# EAGLE design Shutdown_circuit_logic_TNN_V1.0 (EAGLE 9.6.2)

## Sheet 1 of 2
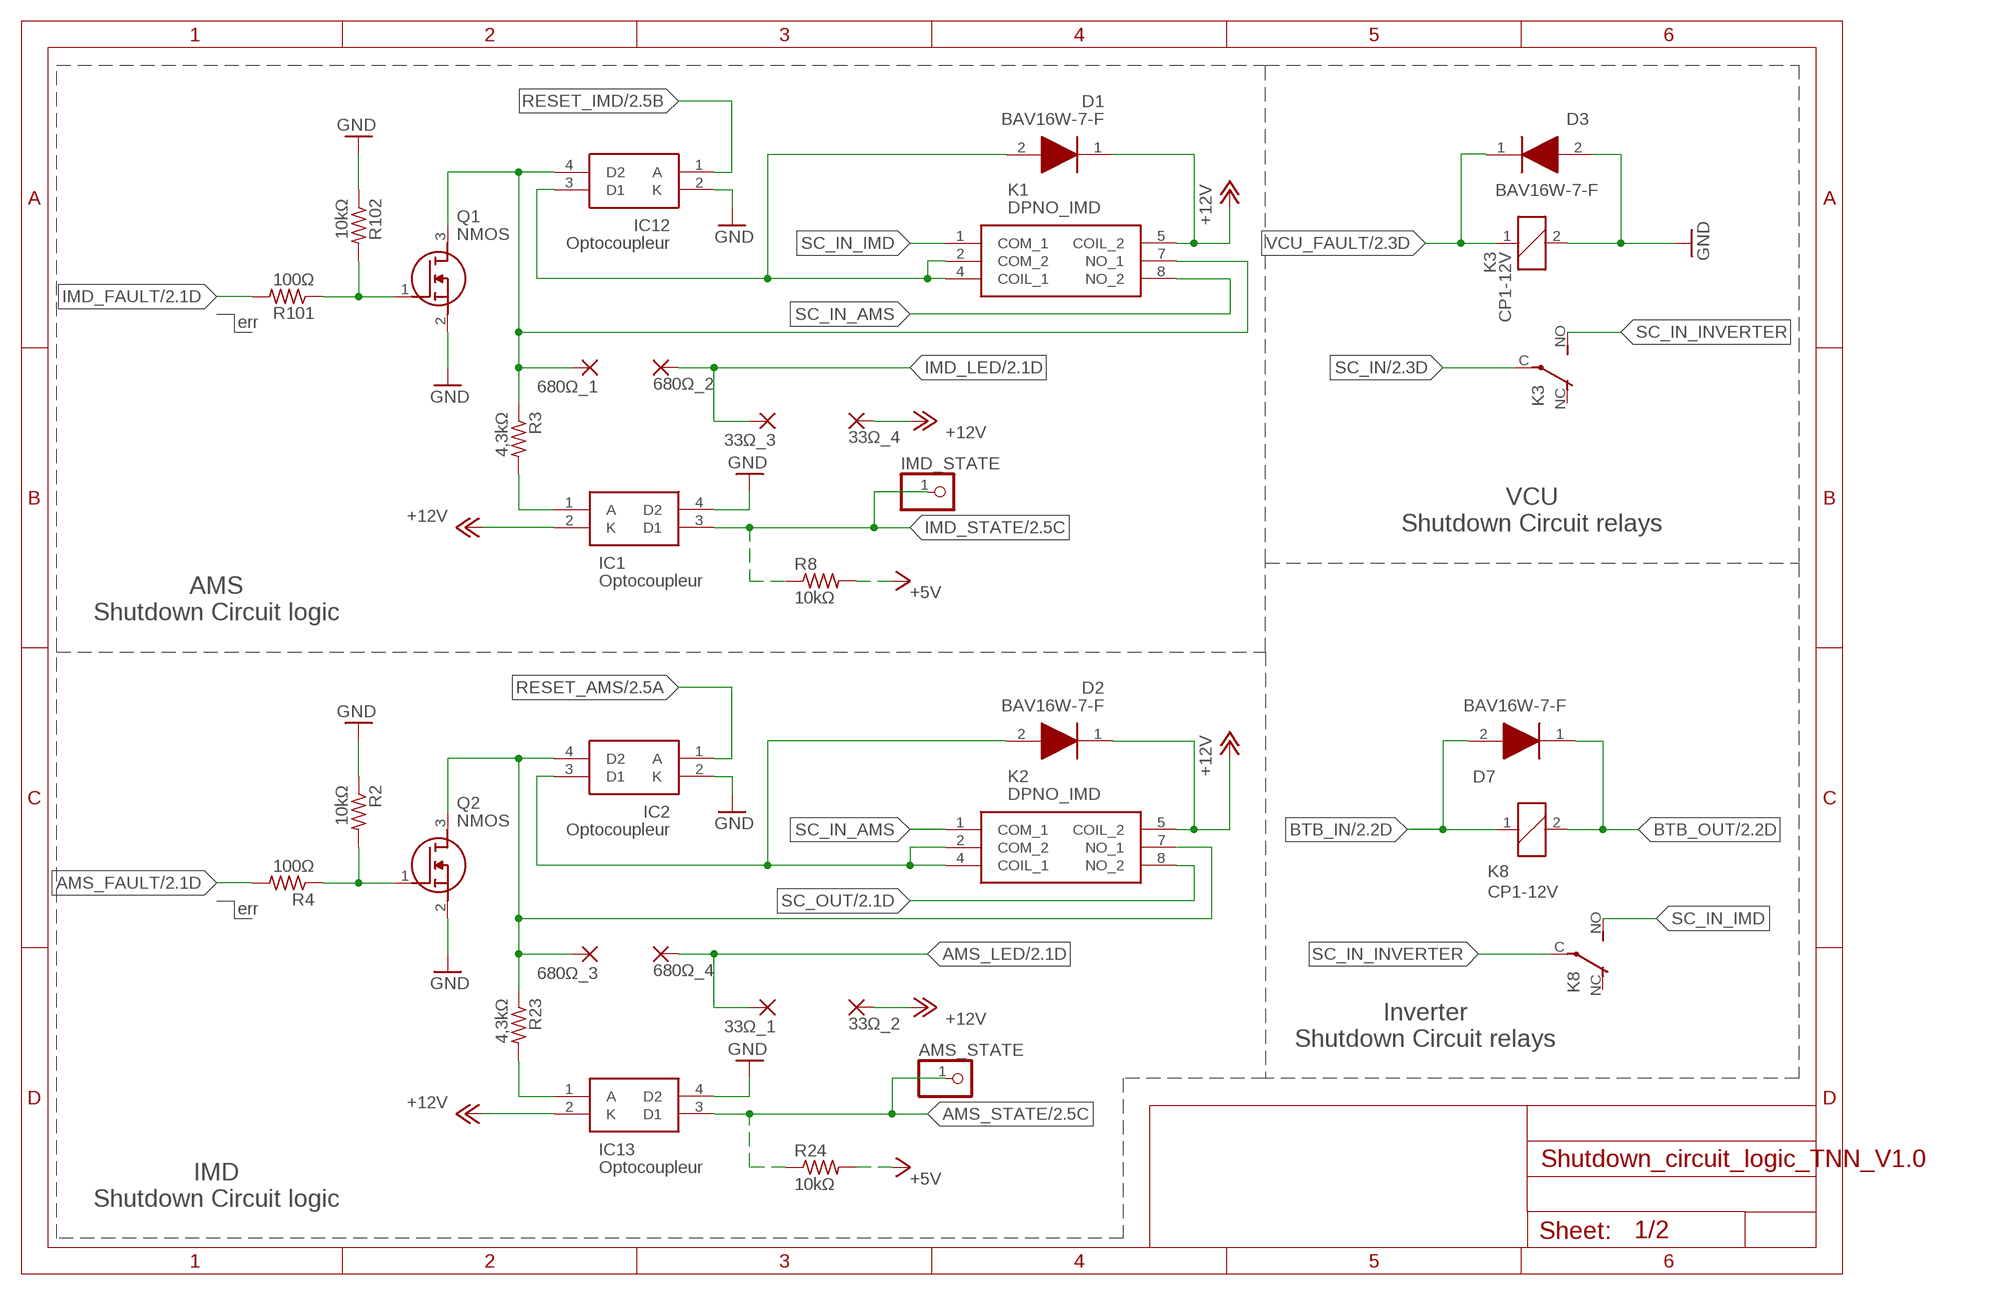
[diagram p0: schematic, sheet 1]

### Parts
33Ω_1  1,6/0,8  [1,6/0,8]
33Ω_2  1,6/0,8  [1,6/0,8]
33Ω_3  1,6/0,8  [1,6/0,8]
33Ω_4  1,6/0,8  [1,6/0,8]
680Ω_1  1,6/0,8  [1,6/0,8]
680Ω_2  1,6/0,8  [1,6/0,8]
680Ω_3  1,6/0,8  [1,6/0,8]
680Ω_4  1,6/0,8  [1,6/0,8]
AMS_STATE  PINHD-1X1  [1X01]
D1  BAV16W-7-F  [SOD3716X145N]
D2  BAV16W-7-F  [SOD3716X145N]
D3  BAV16W-7-F  [SOD3716X145N]
D7  BAV16W-7-F  [SOD3716X145N]
IC1  Optocoupleur  AQY221R2S  [SOP254P680X230-4N]
IC2  Optocoupleur  AQY221R2S  [SOP254P680X230-4N]
IC12  Optocoupleur  AQY221R2S  [SOP254P680X230-4N]
IC13  Optocoupleur  AQY221R2S  [SOP254P680X230-4N]
IMD_STATE  PINHD-1X1  [1X01]
K1  DPNO_IMD  AHES3292  [AHES3292]
K2  DPNO_IMD  AHES3292  [AHES3292]
K3  CP1-12V  [CP1]
K8  CP1-12V  [CP1]
Q1  NMOS  DMN2041L-7  [SOT96P240X110-3N]
Q2  NMOS  DMN2041L-7  [SOT96P240X110-3N]
R2  10kΩ  R-US_R0603  [R0603]
R3  4,3kΩ  R-US_R0603  [R0603]
R4  100Ω  R-US_R0603  [R0603]
R8  10kΩ  R-US_R0603  [R0603]
R23  4,3kΩ  R-US_R0603  [R0603]
R24  10kΩ  R-US_R0603  [R0603]
R101  100Ω  R-US_R0603  [R0603]
R102  10kΩ  R-US_R0603  [R0603]

### Nets
+5V [5V]: R8.2 R24.2 ; also sheet 2
+12V [12V]: 33Ω_2.1(P) 33Ω_4.1(P) D1.1(K) D2.1(K) IC1.2(K) IC13.2(K) K1.5(COIL_2) K2.5(COIL_2) ; also sheet 2
AMS_FAULT: R4.2 ; also sheet 2
AMS_LED: 33Ω_1.1(P) 680Ω_4.1(P) ; also sheet 2
AMS_STATE: AMS_STATE.1 IC13.3(D1) R24.1 ; also sheet 2
BTB_IN: D7.2(A) K8.1 ; also sheet 2
BTB_OUT: D7.1(K) K8.2 ; also sheet 2
GND [Signal]: D3.2(A) IC1.4(D2) IC2.2(K) IC12.2(K) IC13.4(D2) K3.2 Q1.2(S) Q2.2(S) R2.1 R102.1 ; also sheet 2
IMD_FAULT: R101.2 ; also sheet 2
IMD_LED: 33Ω_3.1(P) 680Ω_2.1(P) ; also sheet 2
IMD_STATE: IC1.3(D1) IMD_STATE.1 R8.1 ; also sheet 2
N$5: Q2.1(G) R2.2 R4.1
N$17: Q1.1(G) R101.1 R102.2
N$22: 680Ω_3.1(P) IC2.4(D2) K2.7(NO_1) Q2.3(D) R23.1
N$23: IC1.1(A) R3.2
N$25: 680Ω_1.1(P) IC12.4(D2) K1.7(NO_1) Q1.3(D) R3.1
N$26: D2.2(A) IC2.3(D1) K2.2(COM_2) K2.4(COIL_1)
N$27: IC13.1(A) R23.2
N$29: D1.2(A) IC12.3(D1) K1.2(COM_2) K1.4(COIL_1)
RESET_AMS: IC2.1(A) ; also sheet 2
RESET_IMD: IC12.1(A) ; also sheet 2
SC_IN: K3.C(2:P) ; also sheet 2
SC_IN_AMS: K1.8(NO_2) K2.1(COM_1)
SC_IN_IMD: K1.1(COM_1) K8.NO(2:S)
SC_IN_INVERTER: K3.NO(2:S) K8.C(2:P)
SC_OUT: K2.8(NO_2) ; also sheet 2
VCU_FAULT: D3.1(K) K3.1 ; also sheet 2
Unconnected: K3.NC(2:O) K8.NC(2:O)

### Notes on the sheet
- err
- VCU
  Shutdown Circuit relays
- AMS
  Shutdown Circuit logic
- err
- Inverter
  Shutdown Circuit relays
- IMD
  Shutdown Circuit logic

## Sheet 2 of 2
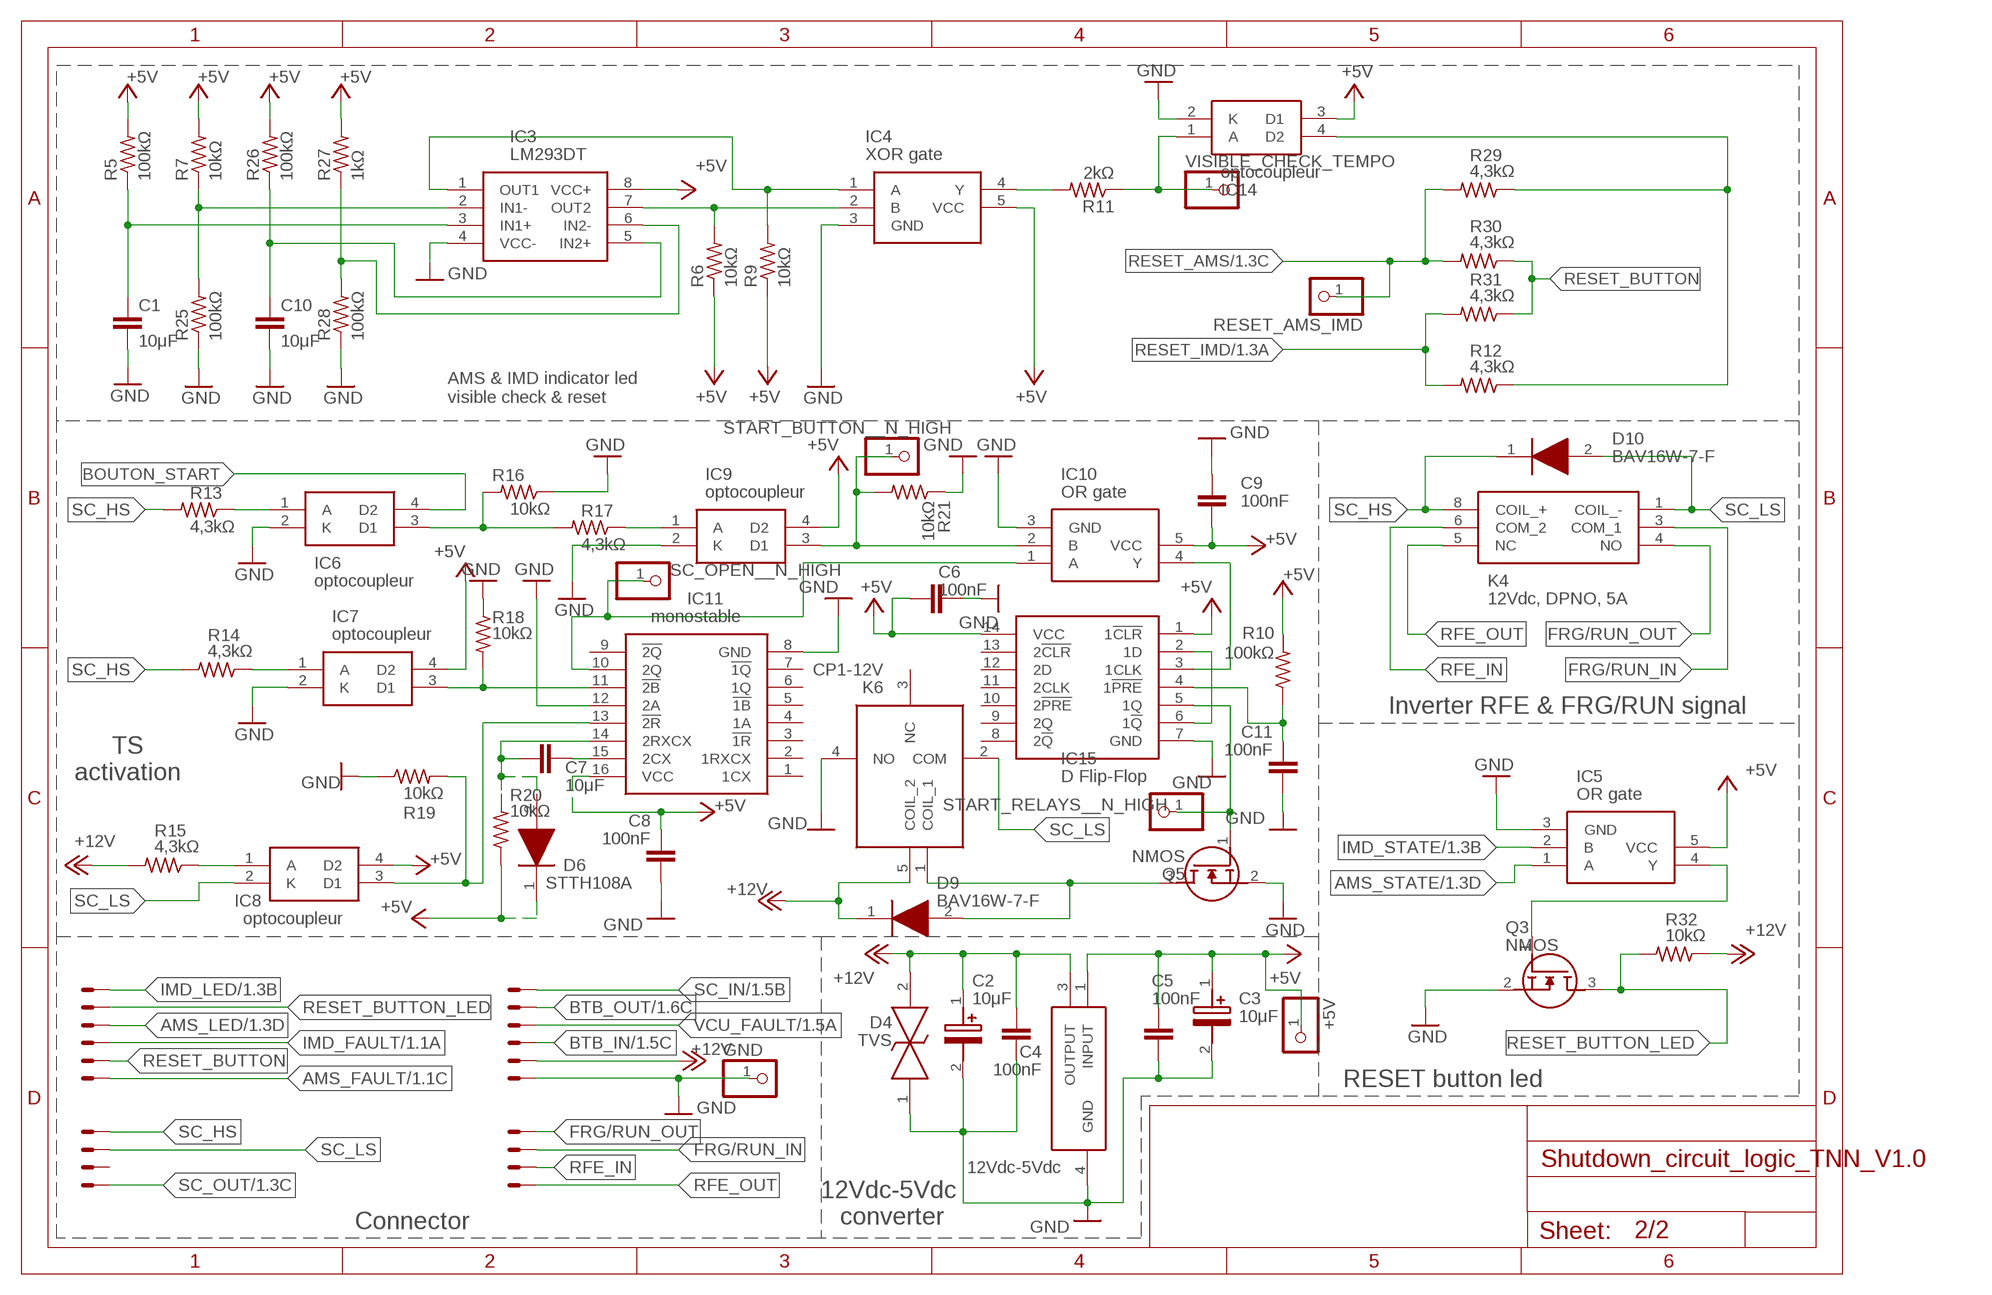
[diagram p1: schematic, sheet 2]

### Parts
+5V  PINHD-1X1  [1X01]
C1  10μF  C-EUC0603  [C0603]
C2  10μF  ECA1VM100  [CAPPRD200W55D525H1200]
C3  10μF  ECA1VM100  [CAPPRD200W55D525H1200]
C4  100nF  C-EUC0603  [C0603]
C5  100nF  C-EUC0603  [C0603]
C6  100nF  C-EUC0603  [C0603]
C7  10μF  C-EUC0603  [C0603]
C8  100nF  C-EUC0603  [C0603]
C9  100nF  C-EUC0603  [C0603]
C10  10μF  C-EUC0603  [C0603]
C11  100nF  C-EUC0603  [C0603]
CONVERTER  12Vdc-5Vdc  L4941BDT-TR  [TO228P972X240-3N]
D4  TVS  CDSOD323-T15SC  [SOD-323]
D6  STTH108A  [DIOM5126X265N]
D9  BAV16W-7-F  [SOD3716X145N]
D10  BAV16W-7-F  [SOD3716X145N]
GND  PINHD-1X1  [1X01]
IC3  LM293DT  [SOIC127P600X175-8N]
IC4  XOR gate  SN74LVC1G86DCKR  [SOT65P210X110-5N]
IC5  OR gate  SN74LVC1G32DBVR  [SOT95P280X145-5N]
IC6  optocoupleur  AQY221R2S  [SOP254P680X230-4N]
IC7  optocoupleur  AQY221R2S  [SOP254P680X230-4N]
IC8  optocoupleur  AQY221R2S  [SOP254P680X230-4N]
IC9  optocoupleur  AQY221R2S  [SOP254P680X230-4N]
IC10  OR gate  SN74LVC1G32DBVR  [SOT95P280X145-5N]
IC11  monostable  CD74HCT4538M96  [SOIC127P600X175-16N]
IC14  optocoupleur  AQY221R2S  [SOP254P680X230-4N]
IC15  D Flip-Flop  SN74AC74DE4  [SOIC127P600X175-14N]
K4  12Vdc, DPNO, 5A  G6B-2214P-US_12DC  [G6B2214PUS12DC]
K6  CP1-12V  [CP1FORMC_1]
Q3  NMOS  DMN2041L-7  [SOT96P240X110-3N]
Q5  NMOS  DMN2041L-7  [SOT96P240X110-3N]
R5  100kΩ  R-US_R0603  [R0603]
R6  10kΩ  R-US_R0603  [R0603]
R7  10kΩ  R-US_R0603  [R0603]
R9  10kΩ  R-US_R0603  [R0603]
R10  100kΩ  R-US_R0603  [R0603]
R11  2kΩ  R-US_R0603  [R0603]
R12  4,3kΩ  R-US_R0603  [R0603]
R13  4,3kΩ  R-US_R0603  [R0603]
R14  4,3kΩ  R-US_R0603  [R0603]
R15  4,3kΩ  R-US_R0603  [R0603]
R16  10kΩ  R-US_R0603  [R0603]
R17  4,3kΩ  R-US_R0603  [R0603]
R18  10kΩ  R-US_R0603  [R0603]
R19  10kΩ  R-US_R0603  [R0603]
R20  10kΩ  R-US_R0603  [R0603]
R21  10kΩ  R-US_R0603  [R0603]
R25  100kΩ  R-US_R0603  [R0603]
R26  100kΩ  R-US_R0603  [R0603]
R27  1kΩ  R-US_R0603  [R0603]
R28  100kΩ  R-US_R0603  [R0603]
R29  4,3kΩ  R-US_R0603  [R0603]
R30  4,3kΩ  R-US_R0603  [R0603]
R31  4,3kΩ  R-US_R0603  [R0603]
R32  10kΩ  R-US_R0603  [R0603]
RESET_AMS_IMD  PINHD-1X1  [1X01]
SC_OPEN__N_HIGH  PINHD-1X1  [1X01]
START_BUTTON__N_HIGH  PINHD-1X1  [1X01]
START_RELAYS__N_HIGH  PINHD-1X1  [1X01]
VISIBLE_CHECK_TEMPO  PINHD-1X1  [1X01]
X1  22-23-2041  [22-23-2041]
X2  22-23-2041  [22-23-2041]
X3  22-23-2061  [22-23-2061]
X4  22-23-2061  [22-23-2061]

### Nets
+5V [5V]: +5V.1 C3.1(+) C5.1 C6.2 C8.2 C9.2 CONVERTER.1(INPUT) D6.1(K) IC3.8(VCC+) IC4.5(VCC) IC5.5(VCC) IC7.4(D2) IC8.4(D2) IC9.4(D2) IC10.5(VCC) IC11.16(VCC) IC14.3(D1) IC15.1(1!CLR) IC15.14(VCC) R5.2 R6.1 R7.2 R9.1 R10.2 R20.1 R26.2 R27.2 ; also sheet 1
+12V [12V]: C2.1(+) C4.1 CONVERTER.3(OUTPUT) D4.2 D9.1(K) K6.5(COIL_2) R15.2 R32.1 X4.2 ; also sheet 1
AMS_FAULT: X3.1 ; also sheet 1
AMS_LED: X3.4 ; also sheet 1
AMS_STATE: IC5.1(A) ; also sheet 1
BOUTON_START: IC6.4(D2)
BTB_IN: X4.3 ; also sheet 1
BTB_OUT: X4.5 ; also sheet 1
FRG/RUN_IN: K4.3(COM_1) X2.3
FRG/RUN_OUT: K4.4(NO) X2.4
GND [Signal]: C1.2 C2.2(-) C3.2(-) C4.2 C5.2 C6.1 C8.1 C9.1 C10.2 C11.1 CONVERTER.4(GND) D4.1 GND.1 IC3.4(VCC-) IC4.3(GND) IC5.3(GND) IC6.2(K) IC7.2(K) IC9.2(K) IC10.3(GND) IC11.8(GND) IC11.12(2A) IC14.2(K) IC15.7(GND) K6.4(NO) Q3.2(S) Q5.2(S) R16.1 R18.1 R19.1 R21.1 R25.1 R28.1 X4.1 ; also sheet 1
IMD_FAULT: X3.3 ; also sheet 1
IMD_LED: X3.6 ; also sheet 1
IMD_STATE: IC5.2(B) ; also sheet 1
N$1: C1.1 IC3.3(IN1+) R5.1
N$2: IC3.2(IN1-) R7.1 R25.2
N$3: IC6.1(A) R13.1
N$4: C10.1 IC3.5(IN2+) R26.1
N$6: IC6.3(D1) R16.2 R17.2
N$7: IC10.1(A) IC11.10(2Q) SC_OPEN__N_HIGH.1
N$8: C7.2 D6.2(A) IC11.14(2RXCX) R20.2
N$9: IC7.1(A) R14.1
N$10: IC7.3(D1) IC11.11(!2B) R18.2
N$11: IC8.1(A) R15.1
N$12: IC8.3(D1) IC11.13(!2R) R19.2
N$13: IC9.1(A) R17.1
N$14: IC9.3(D1) IC10.2(B) R21.2 START_BUTTON__N_HIGH.1
N$15: IC15.5(1Q) Q5.1(G) START_RELAYS__N_HIGH.1
N$16: IC5.4(Y) Q3.1(G)
N$18: IC10.4(Y) IC15.3(1CLK)
N$19: IC3.6(IN2-) R27.1 R28.2
N$20: IC3.1(OUT1) IC4.1(A) R9.2
N$21: IC3.7(OUT2) IC4.2(B) R6.2
N$24: IC14.1(A) R11.1 VISIBLE_CHECK_TEMPO.1
N$37: IC14.4(D2) R12.1 R29.1
N$38: IC4.4(Y) R11.2
N$39: C7.1 IC11.15(2CX)
N$41: IC15.2(1D) IC15.6(1!Q)
N$42: D9.2(A) K6.1(COIL_1) Q5.3(D)
N$43: C11.2 IC15.4(1!PRE) R10.1
RESET_AMS: R29.2 R30.2 RESET_AMS_IMD.1 ; also sheet 1
RESET_BUTTON: R30.1 R31.1 X3.2
RESET_BUTTON_LED: Q3.3(D) R32.2 X3.5
RESET_IMD: R12.2 R31.2 ; also sheet 1
RFE_IN: K4.6(COM_2) X2.2
RFE_OUT: K4.5(NC) X2.1
SC_HS: D10.1(K) K4.8(COIL_+) R13.2 R14.2 X1.4
SC_IN: X4.6 ; also sheet 1
SC_LS: D10.2(A) IC8.2(K) K4.1(COIL_-) K6.2(COM) X1.3
SC_OUT: X1.1 ; also sheet 1
VCU_FAULT: X4.4 ; also sheet 1
Unconnected: IC11.1(1CX) IC11.2(1RXCX) IC11.3(!1R) IC11.4(1A) IC11.5(!1B) IC11.6(1Q) IC11.7(!1Q) IC11.9(!2Q) IC15.8(2!Q) IC15.9(2Q) IC15.10(2!PRE) IC15.11(2CLK) IC15.12(2D) IC15.13(2!CLR) K6.3(NC) X1.2

### Notes on the sheet
- AMS & IMD indicator led
  visible check & reset
- Inverter RFE & FRG/RUN signal
- TS
  activation
- RESET button led
- 12Vdc-5Vdc 
  converter
- Connector

## Library data of the parts
33Ω_1-33Ω_4 680Ω_1-680Ω_4 = wirepad:1,6/0,8: THROUGH-HOLE PAD
+5V AMS_STATE GND IMD_STATE RESET_AMS_IMD SC_OPEN__N_HIGH START_BUTTON__N_HIGH START_RELAYS__N_HIGH VISIBLE_CHECK_TEMPO = pinhead:PINHD-1X1: PIN HEADER
C1 C4-C11 = rcl:C-EU: CAPACITOR, European symbol; SPICEPREFIX: C
C2 C3 = ECA1VM100:ECA1VM100: M radial Al elect cap,10uF 35V 85deg C Panasonic 10uF 35 V dc Aluminium Electrolytic Capacitor, M Series 2000h Source: Datasheet <http://industrial.panasonic.com/cdbs/www-data/pdf/RDF0000/ABA0000C1218.pdf>; DESCRIPTION: M radial Al elect cap,10uF 35V 85deg C Panasonic 10uF 35 V dc Aluminium Electrolytic Capacitor, M Series 2000h; HEIGHT: 12mm; MANUFACTURER_NAME: Panasonic; MANUFACTURER_PART_NUMBER: ECA1VM100
CONVERTER = L4941BDT-TR:L4941BDT-TR: L4941BDT-TR, Low Dropout Voltage Regulator, 1A, 5 V +/-4%, 3-Pin DPAK Source: Datasheet <http://www.st.com/web/en/resource/technical/document/datasheet/CD00000443.pdf>; ARROW_PART_NUMBER: L4941BDT-TR; ARROW_PRICE-STOCK: https://www.arrow.com/en/products/l4941bdt-tr/stmicroelectronics?region=nac; DESCRIPTION: L4941BDT-TR, Low Dropout Voltage Regulator, 1A, 5 V +/-4%, 3-Pin DPAK; HEIGHT: 2.4mm; MANUFACTURER_NAME: STMicroelectronics; MANUFACTURER_PART_NUMBER: L4941BDT-TR; MOUSER_PART_NUMBER: 511-L4941BDT-TR; MOUSER_PRICE-STOCK: https://www.mouser.co.uk/ProductDetail/STMicroelectronics/L4941BDT-TR?qs=tPFdqECvbMIySYN92F2N4Q%3D%3D
D1-D3 D7 = SamacSys_Parts:BAV16W-7-F: Diode Switching 100V 0.15A 2Pin SOD123 Diodes Inc BAV16W-7-F Switching Diode, 300mA 100V, 2-Pin SOD-123 Source: Datasheet; ALLIED_NUMBER: 70437641; DESCRIPTION: Diode Switching 100V 0.15A 2Pin SOD123 Diodes Inc BAV16W-7-F Switching Diode, 300mA 100V, 2-Pin SOD-123; HEIGHT: 1.45mm; MANUFACTURER_NAME: Diodes Inc.; MANUFACTURER_PART_NUMBER: BAV16W-7-F; RS_PART_NUMBER: 7513430P; RS_PRICE-STOCK: http://uk.rs-online.com/web/p/products/7513430P
D4 = CDSOD323-T15SC:CDSOD323-T15SC: TVS Diode ESD 15V BiDirectional SOD323 Bourns CDSOD323-T15SC Bi-Directional TVS Diode, 400W peak, 2-Pin SOD-323 Source: Datasheet <https://datasheet.datasheetarchive.com/originals/distributors/Datasheets-DGA26/1841678.pdf>; ARROW_PART_NUMBER: CDSOD323-T15SC; ARROW_PRICE-STOCK: https://www.arrow.com/en/products/cdsod323-t15sc/bourns?region=nac; DESCRIPTION: TVS Diode ESD 15V BiDirectional SOD323 Bourns CDSOD323-T15SC Bi-Directional TVS Diode, 400W peak, 2-Pin SOD-323; HEIGHT: mm; MANUFACTURER_NAME: Bourns; MANUFACTURER_PART_NUMBER: CDSOD323-T15SC; MOUSER_PART_NUMBER: 652-CDSOD323-T15SC; MOUSER_PRICE-STOCK: https://www.mouser.co.uk/ProductDetail/Bourns/CDSOD323-T15SC?qs=6S5Watp5UnLvz%2FtnS7XuhA%3D%3D
D6 = STTH108A:STTH108A: STTH108A, Fast Rectifier Diode, Switching 1A max, 800V 75ns, 2-Pin, SMA Source: Datasheet <http://www.st.com/web/en/resource/technical/document/datasheet/CD00003259.pdf>; ARROW_PART_NUMBER: STTH108A; ARROW_PRICE-STOCK: https://www.arrow.com/en/products/stth108a/stmicroelectronics; DESCRIPTION: STTH108A, Fast Rectifier Diode, Switching 1A max, 800V 75ns, 2-Pin, SMA; HEIGHT: 2.65mm; MANUFACTURER_NAME: STMicroelectronics; MANUFACTURER_PART_NUMBER: STTH108A; MOUSER_PART_NUMBER: 511-STTH108A; MOUSER_PRICE-STOCK: https://www.mouser.co.uk/ProductDetail/STMicroelectronics/STTH108A?qs=JquAdH79uraWtge35p8qAg%3D%3D
D9 D10 = BAV16W-7-F:BAV16W-7-F: Diode Switching 100V 0.15A 2Pin SOD123 Diodes Inc BAV16W-7-F Switching Diode, 300mA 100V, 2-Pin SOD-123 Source: Datasheet; ARROW_PART_NUMBER: BAV16W-7-F; ARROW_PRICE-STOCK: https://www.arrow.com/en/products/bav16w-7-f/diodes-incorporated; DESCRIPTION: Diode Switching 100V 0.15A 2Pin SOD123 Diodes Inc BAV16W-7-F Switching Diode, 300mA 100V, 2-Pin SOD-123; HEIGHT: 1.45mm; MANUFACTURER_NAME: Diodes Inc.; MANUFACTURER_PART_NUMBER: BAV16W-7-F; MOUSER_PART_NUMBER: 621-BAV16W-F; MOUSER_PRICE-STOCK: https://www.mouser.co.uk/ProductDetail/Diodes-Incorporated/BAV16W-7-F?qs=Ge55vsXlF7cElS2bbKfO8A%3D%3D
IC1 IC2 IC6-IC9 IC12-IC14 = AQY221R2S:AQY221R2S: SPST-NO Solid State Relay 250 mA PCB Mount PhotoMOS, 1.5 V Source: Datasheet <https://datasheet.datasheetarchive.com/originals/distributors/SFDatasheet-4/sf-00084072.pdf>; ARROW_PART_NUMBER: AQY221R2S; ARROW_PRICE-STOCK: https://www.arrow.com/en/products/aqy221r2s/panasonic; DESCRIPTION: SPST-NO Solid State Relay 250 mA PCB Mount PhotoMOS, 1.5 V; HEIGHT: 2.3mm; MANUFACTURER_NAME: Panasonic; MANUFACTURER_PART_NUMBER: AQY221R2S; MOUSER_PART_NUMBER: 769-AQY221R2S; MOUSER_PRICE-STOCK: https://www.mouser.co.uk/ProductDetail/Panasonic-Industrial-Devices/AQY221R2S?qs=mTeSeKeuVA570TSPtWARNQ%3D%3D
IC3 = LM293DT:LM293DT: Low power dual voltage comparators Source: Datasheet <http://www.st.com/web/en/resource/technical/document/datasheet/CD00000465.pdf>; ARROW_PART_NUMBER: LM293DT; ARROW_PRICE-STOCK: https://www.arrow.com/en/products/lm293dt/stmicroelectronics?region=europe; DESCRIPTION: Low power dual voltage comparators; HEIGHT: 1.75mm; MANUFACTURER_NAME: STMicroelectronics; MANUFACTURER_PART_NUMBER: LM293DT; MOUSER_PART_NUMBER: 511-LM293DT; MOUSER_PRICE-STOCK: https://www.mouser.co.uk/ProductDetail/STMicroelectronics/LM293DT?qs=8Bu%252BF5HPnlzADNRUf2Meow%3D%3D
IC4 = SN74LVC1G86DCKR:SN74LVC1G86DCKR: Texas Instruments SN74LVC1G86DCKR, XOR 2 Input XOR, 1.65 5.5 V, 5-Pin SC-70 Source: Datasheet <http://www.ti.com/lit/gpn/sn74lvc1g86>; ARROW_PART_NUMBER: SN74LVC1G86DCKR; ARROW_PRICE-STOCK: https://www.arrow.com/en/products/sn74lvc1g86dckr/texas-instruments?region=nac; DESCRIPTION: Texas Instruments SN74LVC1G86DCKR, XOR 2 Input XOR, 1.65 5.5 V, 5-Pin SC-70; HEIGHT: 1.1mm; MANUFACTURER_NAME: Texas Instruments; MANUFACTURER_PART_NUMBER: SN74LVC1G86DCKR; MOUSER_PART_NUMBER: 595-SN74LVC1G86DCKR; MOUSER_PRICE-STOCK: https://www.mouser.co.uk/ProductDetail/Texas-Instruments/SN74LVC1G86DCKR?qs=d9gICRQKuCdmtPquTT%2F3UA%3D%3D
IC5 IC10 = SN74LVC1G32DBVR:SN74LVC1G32DBVR: Texas Instruments SN74LVC1G32DBVR, 2-Input OR Logic Gate, 1.65 5.5 V, 5-Pin SOT-23 Source: Datasheet <http://www.ti.com/lit/gpn/sn74lvc1g32>; ARROW_PART_NUMBER: SN74LVC1G32DBVR; ARROW_PRICE-STOCK: https://www.arrow.com/en/products/sn74lvc1g32dbvr/texas-instruments?region=nac; DESCRIPTION: Texas Instruments SN74LVC1G32DBVR, 2-Input OR Logic Gate, 1.65 5.5 V, 5-Pin SOT-23; HEIGHT: 1.45mm; MANUFACTURER_NAME: Texas Instruments; MANUFACTURER_PART_NUMBER: SN74LVC1G32DBVR; MOUSER_PART_NUMBER: 595-SN74LVC1G32DBVR; MOUSER_PRICE-STOCK: https://www.mouser.co.uk/ProductDetail/Texas-Instruments/SN74LVC1G32DBVR?qs=3pnr37ZAbK%2F6ArGi%2FPb2Ng%3D%3D
IC11 = CD74HCT4538M96:CD74HCT4538M96: Texas Instruments CD74HCT4538M96 Dual Monostable Multivibrator 4mA, 4.5 5.5 V, 16-Pin SOIC Source: Datasheet <https://www.ti.com/lit/ds/symlink/cd74hct4538.pdf?ts=1617776233717&ref_url=https%3A%2F%2Fwww.ti.com%2Fstore%2Fti%2Fen%2Fp%2Fproduct%2F%3Fp%3DCD74HCT4538M96%26keyMatch%3DCD74HCT4538M96%26tisearch%3Dsearch-everything%26usecas>; ARROW_PART_NUMBER: CD74HCT4538M96; ARROW_PRICE-STOCK: https://www.arrow.com/en/products/cd74hct4538m96/texas-instruments; DESCRIPTION: Texas Instruments CD74HCT4538M96 Dual Monostable Multivibrator 4mA, 4.5 5.5 V, 16-Pin SOIC; HEIGHT: 1.75mm; MANUFACTURER_NAME: Texas Instruments; MANUFACTURER_PART_NUMBER: CD74HCT4538M96; MOUSER_PART_NUMBER: 595-CD74HCT4538M96; MOUSER_PRICE-STOCK: https://www.mouser.com/Search/Refine.aspx?Keyword=595-CD74HCT4538M96
IC15 = SN74AC74DE4:SN74AC74DE4: Flip-Flops Dual Pos-Edge-Trig D-Type Flip-Flop Source: Datasheet <http://www.ti.com/general/docs/suppproductinfo.tsp?distId=26&gotoUrl=http://www.ti.com/lit/gpn/sn74ac74>; DESCRIPTION: Flip-Flops Dual Pos-Edge-Trig D-Type Flip-Flop; HEIGHT: 1.75mm; MANUFACTURER_NAME: Texas Instruments; MANUFACTURER_PART_NUMBER: SN74AC74DE4; MOUSER_PART_NUMBER: 595-SN74AC74DE4; MOUSER_PRICE-STOCK: https://www.mouser.co.uk/ProductDetail/Texas-Instruments/SN74AC74DE4?qs=pdM4geFiyZSonhSZLAytyw%3D%3D
K1 K2 = AHES3292:AHES3292: General Purpose Relays ThruHole,24VDC Coil 30x36x40, 35A Source: Datasheet <https://www.mouser.com/datasheet/2/315/mech_eng_hes-1299274.pdf>; ARROW_PART_NUMBER: AHES3292; ARROW_PRICE-STOCK: https://www.arrow.com/en/products/ahes3292/panasonic; DESCRIPTION: General Purpose Relays ThruHole,24VDC Coil 30x36x40, 35A; HEIGHT: 40mm; MANUFACTURER_NAME: Panasonic; MANUFACTURER_PART_NUMBER: AHES3292; MOUSER_PART_NUMBER: 769-AHES3292; MOUSER_PRICE-STOCK: https://www.mouser.co.uk/ProductDetail/Panasonic-Industrial-Devices/AHES3292/?qs=uLrlhPoGzACCyWNQTcfPfA%3D%3D
K3 K8 = relay:CP1?-*: ULTRA-MINIATURE LOW PROFILE AUTOMOTIVE RELAY NAiS Source: http://www.mew-europe.com/.. en_ds_61207_0000.pdf; MF: AROMAT/ MATSUSHITA; MPN: CP1-12V; OC_FARNELL: unknown; OC_NEWARK: 10C5508
K4 = G6B-2214P-US_12DC:G6B-2214P-US_12DC: RELAY, DPST-NO, 250VAC, 30VDC, 5A Source: Datasheet <https://www.omron.com/ecb/products/pdf/en-g6b.pdf>; DESCRIPTION: RELAY, DPST-NO, 250VAC, 30VDC, 5A; HEIGHT: 11mm; MANUFACTURER_NAME: Omron Electronics; MANUFACTURER_PART_NUMBER: G6B-2214P-US 12DC
K6 = CP1-12V:CP1-12V: PANASONIC ELECTRIC WORKS - CP1-12V - RELAY, AUTOMOTIVE, SPDT, 14VDC, 20A Source: Datasheet <http://www.farnell.com/datasheets/1809465.pdf>; ARROW_PART_NUMBER: CP1-12V; ARROW_PRICE-STOCK: https://www.arrow.com/en/products/cp1-12v/panasonic?region=nac; DESCRIPTION: PANASONIC ELECTRIC WORKS - CP1-12V - RELAY, AUTOMOTIVE, SPDT, 14VDC, 20A; HEIGHT: mm; MANUFACTURER_NAME: Panasonic; MANUFACTURER_PART_NUMBER: CP1-12V; MOUSER_PART_NUMBER: 769-CP1-12V; MOUSER_PRICE-STOCK: https://www.mouser.co.uk/ProductDetail/Panasonic-Industrial-Devices/CP1-12V?qs=mTeSeKeuVA7dPPafy7M16g%3D%3D
Q1 Q2 = SamacSys_Parts:DMN2041L-7: Diodes Inc DMN2041L-7 N-channel MOSFET Transistor, 6.4 A, 20 V, 3-Pin SOT-23 Source: Datasheet <https://datasheet.datasheetarchive.com/originals/distributors/Datasheets-DGA23/1582050.pdf>; ARROW_PART_NUMBER: DMN2041L-7; ARROW_PRICE-STOCK: https://www.arrow.com/en/products/dmn2041l-7/diodes-incorporated?region=nac; DESCRIPTION: Diodes Inc DMN2041L-7 N-channel MOSFET Transistor, 6.4 A, 20 V, 3-Pin SOT-23; HEIGHT: 1.1mm; MANUFACTURER_NAME: Diodes Inc.; MANUFACTURER_PART_NUMBER: DMN2041L-7; MOUSER_PART_NUMBER: 621-DMN2041L-7; MOUSER_PRICE-STOCK: https://www.mouser.co.uk/ProductDetail/Diodes-Incorporated/DMN2041L-7?qs=tiksPeNXt0LSbn3jTreVOg%3D%3D
Q3 Q5 = DMN2041L-7:DMN2041L-7: Diodes Inc DMN2041L-7 N-channel MOSFET Transistor, 6.4 A, 20 V, 3-Pin SOT-23 Source: Datasheet <https://datasheet.datasheetarchive.com/originals/distributors/Datasheets-DGA23/1582050.pdf>; ARROW_PART_NUMBER: DMN2041L-7; ARROW_PRICE-STOCK: https://www.arrow.com/en/products/dmn2041l-7/diodes-incorporated?region=nac; DESCRIPTION: Diodes Inc DMN2041L-7 N-channel MOSFET Transistor, 6.4 A, 20 V, 3-Pin SOT-23; HEIGHT: 1.1mm; MANUFACTURER_NAME: Diodes Inc.; MANUFACTURER_PART_NUMBER: DMN2041L-7; MOUSER_PART_NUMBER: 621-DMN2041L-7; MOUSER_PRICE-STOCK: https://www.mouser.co.uk/ProductDetail/Diodes-Incorporated/DMN2041L-7?qs=tiksPeNXt0LSbn3jTreVOg%3D%3D
R2-R21 R23-R32 R101 R102 = rcl:R-US_: RESISTOR, American symbol; SPICEPREFIX: R
X1 X2 = con-molex:22-23-2041: .100" (2.54mm) Center Header - 4 Pin; MF: MOLEX; MPN: 22-23-2041; OC_FARNELL: 1462920; OC_NEWARK: 38C0355
X3 X4 = con-molex:22-23-2061: .100" (2.54mm) Center Header - 6 Pin; MF: MOLEX; MPN: 22-23-2061; OC_FARNELL: 1462922; OC_NEWARK: 27C1933

## Net classes
0 default: clearance 0.2 mm
1 5V: width 0.2 mm, drill 0.4 mm, clearance 0.2 mm
2 12V: width 0.2 mm, drill 0.6 mm, clearance 0.2 mm
3 Signal: width 0.2 mm, drill 0.3 mm, clearance 0.2 mm

## Board
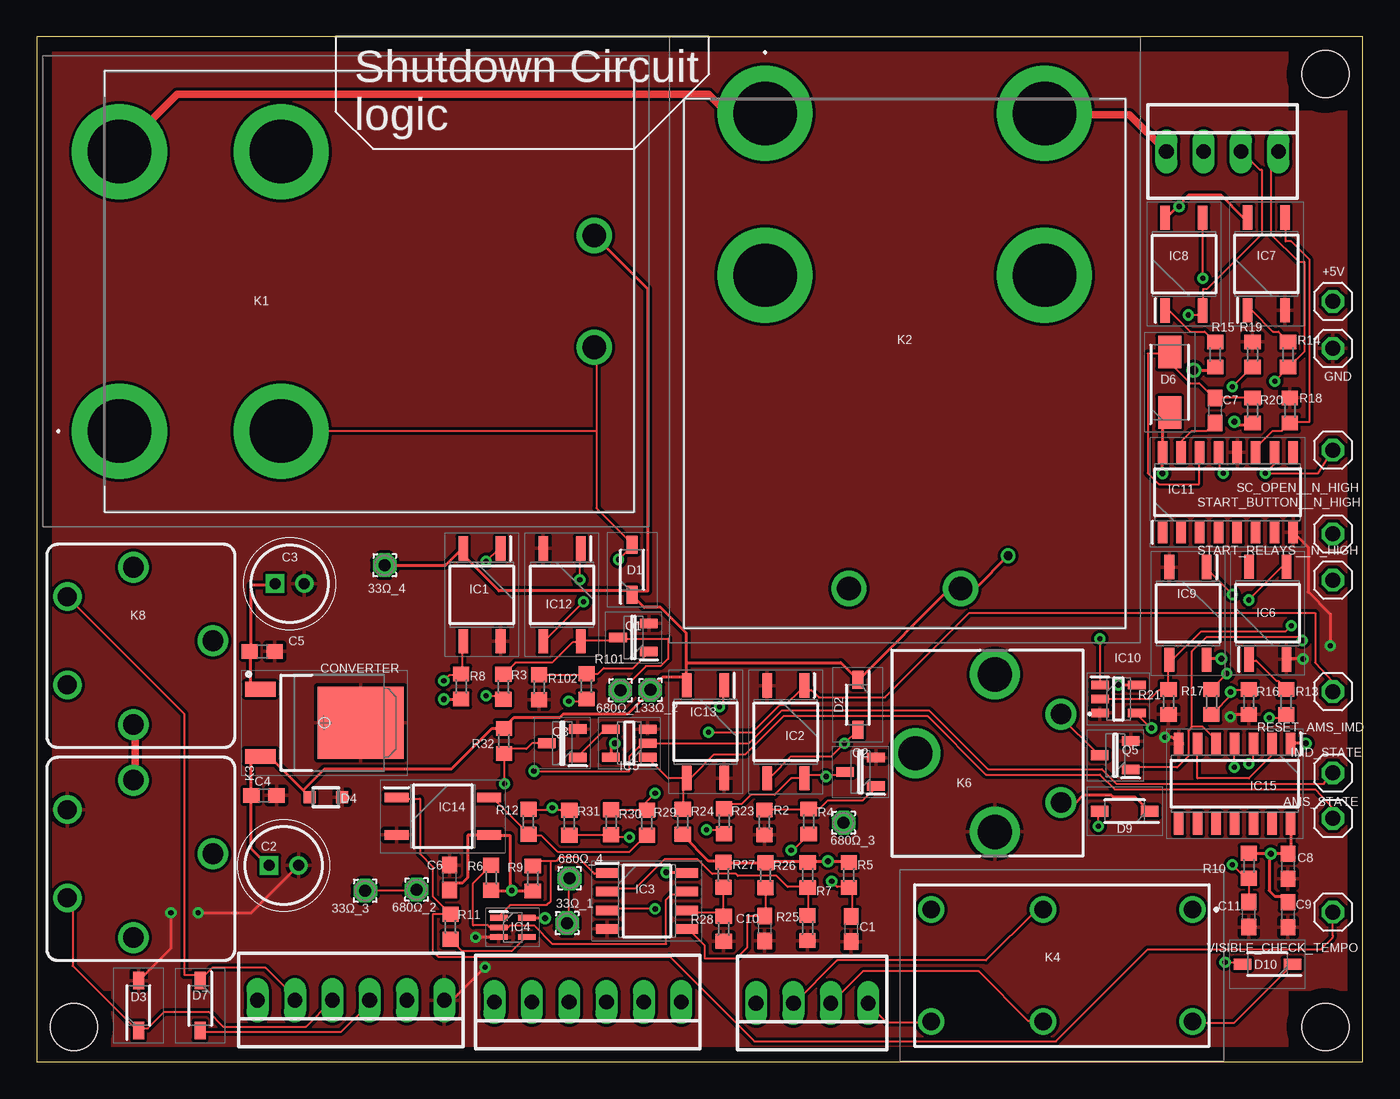
[diagram p2: board, top side]
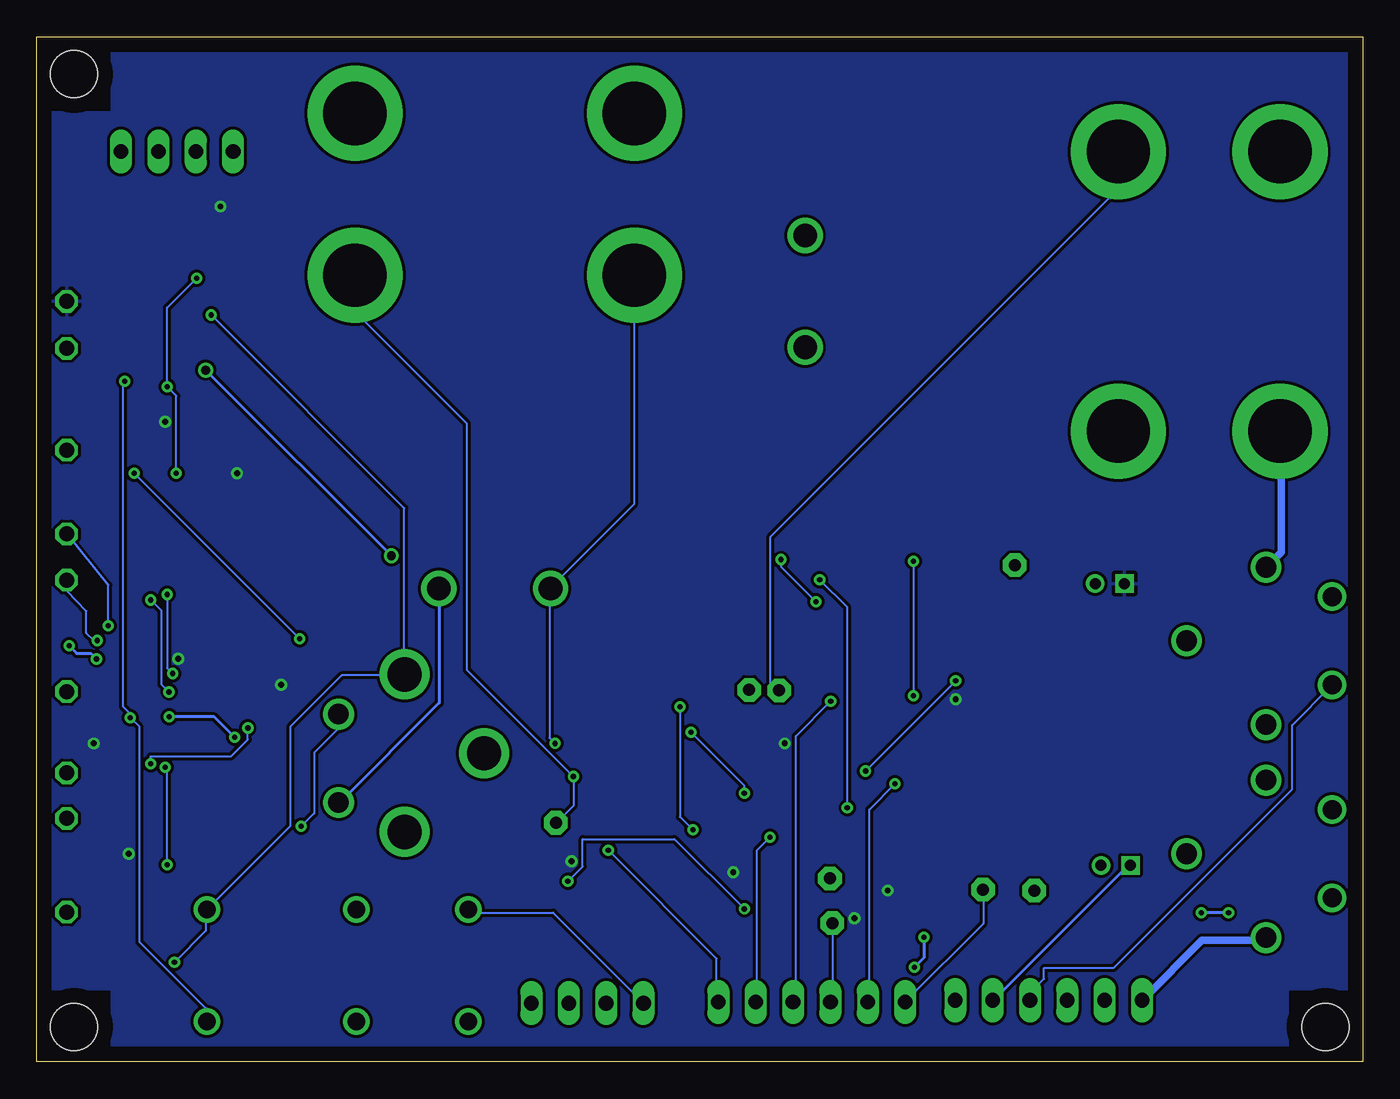
[diagram p3: board, bottom side, seen from below]

Size 90.17 x 69.69 mm. Coordinates in mm from the lower left corner, seen from the top.
Outline: 0,0 90.17,0.01 90.17,69.69 0,69.68 0,0
Copper layers (1*16): Top 0.035mm / dielectric 1.5mm / Bottom 0.035mm
Design rules "default": minimum track width 6mil, minimum drill 0.35mm, track to track 6mil, track to pad 6mil, pad to pad 6mil, via to via 6mil, smd to smd 6mil, copper to edge 40mil, drill to drill 6mil, minimum pad ring 10mil, minimum via ring 8mil, stop-mask expansion 4mil, vias tented up to drill 0mil, thermal gap 10mil
Holes 3.2 mm at 2.54,2.38 87.63,2.38 87.63,67.15

### Footprints (pad centres in the part's own frame; a part is rotated, then mirrored left to right if it is on the bottom)
1,6/0,8 = drill 0.813 pad 1.6 octagon: 1 0,0
1X01 = drill 1.016 octagon: 1 0,0
C0603 = smd 1.1 x 1: 1 -0.85,0; 2 0.85,0
CAPPRD200W55D525H1200 = drill 0.75 pad 1.15 square: 1 0,0 | drill 0.75 pad 1.15: 2 2,0
TO228P972X240-3N = smd 2.1 x 1: 1 -4.35,2.28; 3 -4.35,-2.28 | smd 5.85 x 4.9: 4 2.45,0
SOD3716X145N = smd 1.2 x 0.75: 1 -1.7,0; 2 1.7,0
SOD-323 = smd 0.8 x 0.8: 1 -1.1,0; 2 1.1,0
DIOM5126X265N = smd 2.2 x 1.55: 1 -2.05,0; 2 2.05,0
SOP254P680X230-4N = smd 1.65 x 0.65: 1 -3.15,1.27; 2 -3.15,-1.27; 3 3.15,-1.27; 4 3.15,1.27
SOIC127P600X175-8N = smd 1.525 x 0.65: 1 -2.712,1.905; 2 -2.712,0.635; 3 -2.712,-0.635; 4 -2.712,-1.905; 5 2.712,-1.905; 6 2.712,-0.635; 7 2.712,0.635; 8 2.712,1.905
SOT65P210X110-5N = smd 1.2 x 0.4: 1 -0.95,0.65; 2 -0.95,0; 3 -0.95,-0.65; 4 0.95,-0.65; 5 0.95,0.65
SOT95P280X145-5N = smd 1.2 x 0.6: 1 -1.25,0.95; 2 -1.25,0; 3 -1.25,-0.95; 4 1.25,-0.95; 5 1.25,0.95
SOIC127P600X175-16N = smd 1.525 x 0.65: 1 -2.712,4.445; 2 -2.712,3.175; 3 -2.712,1.905; 4 -2.712,0.635; 5 -2.712,-0.635; 6 -2.712,-1.905; 7 -2.712,-3.175; 8 -2.712,-4.445; 9 2.712,-4.445; 10 2.712,-3.175; 11 2.712,-1.905; 12 2.712,-0.635; 13 2.712,0.635; 14 2.712,1.905; 15 2.712,3.175; 16 2.712,4.445
SOIC127P600X175-14N = smd 1.525 x 0.65: 1 -2.712,3.81; 2 -2.712,2.54; 3 -2.712,1.27; 4 -2.712,0; 5 -2.712,-1.27; 6 -2.712,-2.54; 7 -2.712,-3.81; 8 2.712,-3.81; 9 2.712,-2.54; 10 2.712,-1.27; 11 2.712,0; 12 2.712,1.27; 13 2.712,2.54; 14 2.712,3.81
AHES3292 = drill 4.308 pad 6.462: 1 0,0; 2 0,-11; 7 19,-11; 8 19,0 | drill 1.6 pad 2.4: 4 5.7,-32.3; 5 13.3,-32.3
CP1 = drill 1.3: 1 2.65,-4.5; 2 -3.35,-4.5 | drill 1.4: C 5.35,0; NC -0.35,5.4; NO -5.35,0
G6B2214PUS12DC = drill 1.2 pad 1.8: 1 0,0; 3 10.16,0; 4 17.78,0; 5 17.78,7.62; 6 10.16,7.62; 8 0,7.62
CP1FORMC_1 = drill 1.4 pad 2.1: 1 -8,4.5; 5 -2,4.5 | drill 2.33 pad 3.4: 2 -10.7,0; 3 -5.35,-5.4; 4 0,0
SOT96P240X110-3N = smd 1.2 x 0.65: 1 -1.05,0.96; 2 -1.05,-0.96; 3 1.05,0
R0603 = smd 1 x 1.1: 1 -0.85,0; 2 0.85,0
22-23-2041 = drill 1 long: 1 -3.81,0; 2 -1.27,0; 3 1.27,0; 4 3.81,0
22-23-2061 = drill 1 long: 1 -6.35,0; 2 -3.81,0; 3 -1.27,0; 4 1.27,0; 5 3.81,0; 6 6.35,0

### Placement (x,y rotation side)
33Ω_1  36.07,9.44 0 top
33Ω_2  41.72,25.29 0 top
33Ω_3  22.33,11.64 0 top
33Ω_4  23.66,33.77 0 top
680Ω_1  39.69,25.26 0 top
680Ω_2  25.82,11.71 0 top
680Ω_3  54.87,16.26 0 top
680Ω_4  36.23,12.48 0 top
+5V  88.14,51.71 0 top
AMS_STATE  88.14,16.56 0 top
C1  55.38,9.04 270 top
C2  15.79,13.36 0 top
C3  16.2,32.52 0 top
C4  15.45,18.12 0 top
C5  15.34,27.91 0 top
C6  28.07,12.54 270 top
C7  80.14,44.29 90 top
C8  85.09,13.3 90 top
C9  85.09,10.02 90 top
C10  49.5,9.08 270 top
C11  82.42,10.02 90 top
CONVERTER  19.56,23.05 0 top
D1  40.49,33.46 90 top
D2  55.83,24.28 270 top
D3  6.92,3.84 90 top
D4  19.66,18 180 top
D6  77.04,46.2 90 top
D7  11.11,3.84 270 top
D9  73.98,17.04 180 top
D10  83.69,6.65 180 top
GND  88.14,48.51 0 top
IC1  30.27,31.76 270 top
IC2  50.94,22.44 270 top
IC3  41.5,10.95 0 top
IC4  32.36,9.14 0 top
IC5  40.3,21.68 180 top
IC6  83.7,30.51 90 top
IC7  83.61,54.25 90 top
IC8  78.01,54.24 90 top
IC9  78.29,30.49 270 top
IC10  73.55,24.68 0 top
IC11  80.99,38.73 90 top
IC12  35.71,31.76 270 top
IC13  45.48,22.45 270 top
IC14  27.61,16.7 0 top
IC15  81.46,18.92 270 top
IMD_STATE  88.14,19.65 0 top
K1  5.62,42.89 90 top
K2  49.53,64.48 0 top
K3  6.58,13.81 270 top
K4  78.61,10.36 180 top
K6  65.15,15.64 270 top
K8  6.58,28.28 270 top
Q1  40.58,28.86 180 top
Q2  56.02,19.72 180 top
Q3  35.74,21.67 180 top
Q5  73.34,20.85 180 top
R2  49.48,16.28 90 top
R3  31.73,25.5 270 top
R4  52.49,16.34 270 top
R5  55.22,12.71 90 top
R6  30.9,12.52 90 top
R7  52.43,12.71 90 top
R8  28.86,25.53 270 top
R9  33.74,12.47 90 top
R10  82.42,13.35 90 top
R11  28.13,9.19 270 top
R12  33.44,16.33 90 top
R13  84.96,24.48 270 top
R14  85.09,48.1 270 top
R15  80.14,48.1 270 top
R16  82.42,24.48 90 top
R17  79.88,24.48 270 top
R18  85.22,44.29 270 top
R19  82.68,48.1 270 top
R20  82.68,44.29 90 top
R21  76.96,24.48 90 top
R23  46.74,16.37 270 top
R24  43.93,16.33 270 top
R25  52.41,9.1 90 top
R26  49.55,12.69 90 top
R27  46.69,12.73 90 top
R28  46.71,9.06 90 top
R29  41.49,16.26 90 top
R30  39.06,16.3 90 top
R31  36.21,16.27 90 top
R32  31.77,21.83 270 top
R101  37.38,25.53 270 top
R102  34.16,25.47 90 top
RESET_AMS_IMD  88.14,25.18 0 top
SC_OPEN__N_HIGH  88.14,41.59 0 top
START_BUTTON__N_HIGH  88.14,35.9 0 top
START_RELAYS__N_HIGH  88.14,32.75 0 top
VISIBLE_CHECK_TEMPO  88.14,10.18 0 top
X1  80.62,61.9 0 top
X2  52.72,4 180 top
X3  37.47,4.07 180 top
X4  21.36,4.2 180 top

### Tracks (layer width: path | path; a pad name or v marks a point on that pad's centre or on a via)
+5V  (via drill 0.4)
  Top 0.2: R5.2 55.18,13.65 v53.8,13.65 52.43,13.65 R7.2 52.3,13.65 49.55,13.65 R26.2 49.43,13.53 46.8,13.53 R27.2 46.68,13.65 45.68,13.65 43.93,15.4 R24.2 | 32.18,11.65 30.93,11.65 R6.1 | 32.18,11.65 v32.3,11.65 33.68,11.65 R9.1 | C6.2 28.18,11.78 28.55,12.15 28.93,12.15 29.3,12.53 29.3,15.4 30.68,15.4 IC14.3 30.8,15.4 32.18,15.4 32.18,11.65 | 83.81,14.15 v83.93,14.15 85.06,14.15 C8.2 85.18,14.15 85.31,14.15 85.31,16.15 IC15.14 | 83.81,14.15 82.43,14.15 R10.2 | 83.81,14.15 83.81,11.65 84.18,11.28 84.68,11.28 85.06,10.9 C9.2 | 77.62,58.22 78.31,58.9 80.56,58.9 82.06,57.4 82.31,57.4 IC7.4 | 77.62,58.22 76.81,57.4 IC8.4 | D6.1 76.56,44.15 76.56,41.53 IC11.16 76.56,41.4 v76.56,40.03 | CONVERTER.1 15.18,25.4 14.55,25.4 14.55,27.9 C5.1 14.55,28.03 14.55,32.4 16.18,32.4 C3.1 | v27.68,24.65 28.8,24.65 R8.2 | R20.1 82.51,43.28 81.68,43.28 v81.43,43.53 | v34.55,9.78 33.43,9.78 IC4.5 | v39.3,21.65 39.05,21.65 39.05,20.78 IC5.5 | v73.56,25.65 74.68,25.65 IC10.5 | v42.8,12.9 44.18,12.9 IC3.8 | v86.31,21.65 85.31,21.65 IC15.1 | v80.56,27.4 79.68,27.4 IC9.4 | v77.68,58.15 77.62,58.22
  pour Bottom: 0,69.69 0,4.92 5.08,4.92 5.08,-0.16 85.09,-0.16 85.09,4.92 90.17,4.92 90.17,64.61 85.09,64.61 85.09,69.69
+12V  (via drill 0.6)
  Top 0.2: D9.1 75.56,17.15 74.68,18.03 73.18,18.03 73.06,18.15 71.18,18.15 70.68,17.65 69.68,17.65 K6.5 | v78.68,47.03 79.93,47.03 80.06,47.15 R15.2 | v66.06,34.4 63.93,32.28 62.93,32.28 K2.5 62.8,32.15 62.05,32.15 55.93,26.03 D2.1 55.8,26.03 54.68,27.15 44.18,27.15 | 18.12,18.47 15.93,20.65 15.3,20.65 CONVERTER.3 15.18,20.65 14.55,20.65 14.55,18.15 C4.1 14.55,18.03 14.55,14.53 15.68,13.4 C2.1 | 18.12,18.47 18.55,18.03 D4.2 | 33Ω_4.1 23.68,33.78 27.8,33.78 28.93,34.9 IC1.2 28.8,34.65 31.43,32.03 40.18,32.03 40.43,31.78 D1.1 | 44.18,26.15 44.18,25.65 IC13.2 44.18,26.15 | 44.18,26.15 44.18,27.15 | 44.18,27.15 44.18,29.15 42.43,30.9 41.3,30.9 40.55,31.65 D1.1 | K1.5 37.93,56.15 41.55,52.53 41.55,32.03 40.3,32.03 D1.1 | 44.18,26.15 42.55,26.15 41.8,25.4 33Ω_2.1 41.8,25.28 40.18,23.65 35.8,23.65 35.55,23.4 32.43,23.4 31.8,22.78 R32.1 31.68,22.65 30.93,22.65 28.18,19.9 19.55,19.9 18.12,18.47
  Bottom 0.2: v66.06,34.4 v78.68,47.03 | K6.5 69.56,17.65 62.8,24.4 62.8,32.15 K2.5 | X4.2 25.05,4.28 16.05,13.28 15.8,13.28 C2.1
AMS_FAULT  (via drill 0.35)
  Top 0.152: v51.3,14.4 51.43,14.53 51.55,14.53 52.43,15.4 R4.2
  Bottom 0.152: v51.3,14.4 43.93,7.03 43.93,4.15 X3.1
AMS_LED
  Top 0.152: 680Ω_4.1 36.18,12.4 36.18,9.53 33Ω_1.1
  Bottom 0.152: X3.4 36.18,4.15 36.05,4.28 36.05,9.4 33Ω_1.1
AMS_STATE
  Top 0.152: 43.93,19.28 43.93,17.28 R24.1 | 43.93,19.28 44.18,19.28 IC13.3 | 43.93,19.28 42.93,19.28 41.55,20.65 IC5.1 | 43.93,19.28 IC13.3 | AMS_STATE.1 88.14,17.24 86.94,18.53 73.31,18.53 72.31,19.53 64.56,19.53 60.55,23.53 50.8,23.53 48.18,20.9 46.05,20.9 44.55,19.4 44.3,19.4 IC13.3
BTB_IN
  Top 0.152: D7.2 11.18,2.03 20.68,2.03 22.55,3.9 22.55,4.15 X4.3
  Bottom 0.152: K8.1 2.18,25.53 4.8,22.9 4.8,18.53 16.93,6.4 21.68,6.4 21.68,5.65 22.55,4.78 22.55,4.28 X4.3
BTB_OUT
  Top 0.152: 11.43,5.9 11.93,6.4 15.55,6.4 17.43,4.53 17.43,4.28 X4.5 | 11.43,5.9 11.18,5.65 D7.1 11.43,5.9 | 11.43,5.9 10.05,5.9 10.05,23.65 2.18,31.53 K8.2
FRG/RUN_IN
  Top 0.152: X2.3 51.55,4.03 54.43,6.9 64.56,6.9 67.93,10.28 68.43,10.28 K4.3
FRG/RUN_OUT
  Bottom 0.152: X2.4 48.93,4.03 55.05,10.15 60.8,10.15 60.8,10.28 K4.4
GND  (via drill 0.35)
  Top 0.2: D3.2 9.13,7.75 v9.13,10.14 | v10.97,10.14 14.57,10.14 C2.2 | IC15.7 77.22,22.06 v76.71,22.06 | v81.15,23.46 81.32,23.63 R16.1 | IC11.8 86.45,35 86.45,31.95 87.97,30.44 v87.97,28.29 | v86.11,27.4 85.01,27.4 IC6.2 | IC4.3 29.86,8.49 v29.84,8.48 | v30.48,6.44 28.24,4.2 X4.1
  Bottom 0.2: v9.13,10.14 v10.97,10.14 | v76.71,22.06 78.1,23.46 v81.15,23.46 | v87.97,28.29 87.46,27.78 86.49,27.78 v86.11,27.4 | v29.84,8.48 29.84,7.08 v30.48,6.44
  pour Top: 0,69.69 0,4.92 5.08,4.92 5.08,-0.16 85.09,-0.16 85.09,4.92 90.17,4.92 90.17,64.61 85.09,64.61 85.09,69.69
IMD_FAULT  (via drill 0.35)
  Top 0.152: v36.18,24.53 37.18,24.53 37.3,24.65 R101.2
  Bottom 0.152: v36.18,24.53 38.55,22.15 38.55,4.28 38.68,4.15 X3.3
IMD_LED
  Top 0.152: 33Ω_3.1 22.43,11.65 25.8,11.65 680Ω_2.1
  Bottom 0.152: X3.6 31.05,4.15 25.8,9.4 25.8,11.65 680Ω_2.1
IMD_STATE  (via drill 0.35)
  Top 0.152: IC1.3 28.93,28.53 28.93,26.4 R8.1 28.8,26.28 28.05,26.28 v27.68,25.9 | v33.8,19.78 40.3,19.78 40.3,20.78 40.93,21.4 41.18,21.4 41.43,21.65 IC5.2 41.55,21.65 48.43,21.65 50.68,23.9 60.68,23.9 64.68,19.9 72.43,19.9 73.43,18.9 87.54,18.9 IMD_STATE.1
  Bottom 0.152: v27.68,25.9 v33.8,19.78
N$1  (via drill 0.35)
  Top 0.152: C1.1 55.43,9.9 55.43,11.78 55.3,11.78 R5.1 55.18,11.9 54.43,11.9 v54.05,12.28 | v42.05,10.4 38.8,10.4 IC3.3
  Bottom 0.152: v42.05,10.4 46.8,15.15 53.05,15.15 53.05,13.28 v54.05,12.28
N$2
  Top 0.152: R25.2 52.43,10.03 52.43,11.78 R7.1 52.3,11.9 51.05,11.9 50.3,12.65 47.68,12.65 47.55,12.78 45.93,12.78 44.93,13.78 42.68,13.78 40.68,11.78 38.93,11.78 38.8,11.65 IC3.2
N$3
  Top 0.152: R13.1 84.93,25.4 84.43,25.9 84.31,25.9 82.93,27.28 82.56,27.28 IC6.1
N$4
  Top 0.152: R26.1 49.55,11.78 49.55,10.03 C10.1 49.43,9.9 48.3,9.9 48.3,7.78 47.55,7.03 45.43,7.03 45.43,7.9 44.3,9.03 IC3.5
N$5
  Top 0.152: R2.2 49.55,17.15 52.43,17.15 R4.1 52.55,17.28 53.3,17.28 53.8,17.78 56.18,17.78 57.05,18.65 Q2.1
N$6  (via drill 0.35)
  Top 0.152: 81.31,25.03 81.56,25.28 82.31,25.28 R16.2 | 81.31,25.03 79.93,23.65 R17.2 | v82.43,31.41 84.64,33.61 IC6.3 | 81.31,25.03 v81.18,25.15
  Bottom 0.152: v82.43,31.41 81.68,30.66 81.68,25.65 v81.18,25.15
N$7  (via drill 0.35)
  Top 0.152: v72.31,28.78 72.31,25.65 IC10.1 | IC11.10 84.18,41.4 84.18,40.65 v83.56,40.03 87.15,40.03 SC_OPEN__N_HIGH.1
  Bottom 0.152: v83.56,40.03 v72.31,28.78
N$8
  Top 0.152: R20.2 82.56,45.15 80.18,45.15 C7.2 80.06,45.15 79.06,46.15 78.43,46.15 76.43,48.15 | 76.43,48.15 76.93,48.15 D6.2 76.43,48.15 | 76.43,48.15 75.56,48.15 75.56,40.03 76.31,39.28 79.06,39.28 79.06,41.4 IC11.14
N$9
  Top 0.152: R14.1 85.06,49.03 84.43,49.65 84.06,49.65 82.68,51.03 82.43,51.03 IC7.1
N$10
  Top 0.152: IC11.11 82.93,41.53 82.93,41.78 84.06,42.9 84.68,42.9 85.18,43.4 R18.2 85.31,43.53 86.56,43.53 86.56,54.53 85.31,55.78 84.93,55.78 84.93,57.28 IC7.3
N$11
  Top 0.152: R15.1 80.06,49.03 79.43,49.65 78.43,49.65 77.06,51.03 76.81,51.03 IC8.1
N$12  (via drill 0.35)
  Top 0.152: v81.31,45.9 82.56,47.15 R19.2 | v80.68,40.03 80.43,40.28 80.43,41.4 IC11.13 | v79.31,53.28 79.31,57.28 IC8.3
  Bottom 0.152: v80.68,40.03 80.68,45.28 v81.31,45.9 81.31,51.28 v79.31,53.28
N$13  (via drill 0.35)
  Top 0.152: v80.93,26.4 79.93,25.4 R17.1 | v81.31,31.78 79.56,33.53 IC9.1
  Bottom 0.152: v80.93,26.4 81.31,26.78 v81.31,31.78
N$14  (via drill 0.35)
  Top 0.152: IC10.2 72.31,24.65 75.68,24.65 76.31,25.28 76.93,25.28 R21.2 76.93,25.4 76.93,27.28 IC9.3 77.06,27.4 77.31,27.4 79.18,29.28 84.93,29.28 v85.31,29.65
  Bottom 0.152: START_BUTTON__N_HIGH.1 85.31,32.42 v85.31,29.65
N$15  (via drill 0.35)
  Top 0.152: 78.56,22.78 78.31,22.53 78.31,20.78 77.56,20.03 74.56,20.03 74.43,19.9 Q5.1 | 78.56,22.78 79.31,22.78 80.18,21.9 80.18,21.65 IC15.5 | v86.06,28.65 85.81,28.9 79.56,28.9 78.56,27.9 78.56,22.78
  Bottom 0.152: v86.06,28.65 86.31,28.65 86.81,29.15 86.81,30.65 88.14,32.05 START_RELAYS__N_HIGH.1
N$16
  Top 0.152: Q3.1 36.8,20.78 38.55,22.53 38.93,22.53 IC5.4
N$17
  Top 0.152: R102.2 34.17,26.28 37.3,26.28 R101.1 37.43,26.4 38.18,26.4 38.55,26.78 40.55,26.78 41.55,27.78 Q1.1
N$18  (via drill 0.35)
  Top 0.152: v75.81,22.7 75.76,22.7 74.81,23.65 IC10.4 | v82.43,20.28 82.68,20.53 82.68,21.53 IC15.3
  Bottom 0.152: v75.81,22.7 75.81,21.92 76.95,20.78 82.43,20.78 v82.43,20.28
N$19
  Top 0.152: 46.68,10.15 46.68,11.78 R27.1 | 46.68,10.15 46.68,10.03 R28.2 46.68,10.15 | 46.68,10.15 44.43,10.15 44.3,10.28 IC3.6
N$20
  Top 0.152: 34.93,13.65 35.3,13.65 35.55,13.9 36.8,13.9 37.93,12.78 38.68,12.78 IC3.1 | 34.93,13.65 34.05,13.65 33.8,13.4 R9.2 | 34.93,13.65 34.93,10.9 34.68,10.65 32.18,10.65 31.43,9.9 IC4.1
N$21
  Top 0.152: R6.2 30.8,13.28 29.68,12.15 29.68,9.28 30.68,9.28 30.8,9.15 31.3,9.15 IC4.2 31.43,9.15 32.05,9.15 32.18,9.28 33.8,9.28 35.05,8.03 42.8,8.03 42.8,11.03 43.18,11.4 44.05,11.4 44.18,11.53 IC3.7
N$22  (via drill 0.35)
  Top 0.152: R23.1 46.8,17.28 47.05,17.53 47.93,17.53 48.55,18.15 50.18,18.15 51.3,19.28 52.18,19.28 IC2.4 52.3,19.4 52.43,19.53 53.68,19.53 | 53.68,19.53 54.8,19.53 54.93,19.65 Q2.3 | 53.68,19.53 v53.68,19.4
  Bottom 0.152: 680Ω_3.1 54.8,16.28 53.68,17.4 v53.68,19.4 60.93,26.65 60.93,43.4 68.43,50.9 68.43,53.4 K2.7
N$23  (via drill 0.35)
  Top 0.152: v30.55,24.9 31.43,24.9 31.68,24.65 R3.2 | v30.55,34.03 31.43,34.9 IC1.1
  Bottom 0.152: v30.55,34.03 v30.55,24.9
N$24
  Top 0.152: IC14.1 24.55,17.9 26.05,17.9 26.05,14.15 26.93,13.28 26.93,11.28 28.05,10.15 R11.1 28.05,10.03 26.93,10.03 26.93,7.53 27.3,7.15 43.05,7.15 48.8,1.4 69.31,1.4 75.56,7.65 87.32,7.65 88.09,8.42 88.14,8.59 VISIBLE_CHECK_TEMPO.1
N$25
  Top 0.152: R3.1 31.8,26.4 32.55,27.15 35.05,27.15 36.43,28.53 36.93,28.53 IC12.4 37.05,28.65 39.3,28.65 39.43,28.78 Q1.3 39.55,28.78 42.93,28.78 42.93,27.4 42.43,26.9 41.43,26.9 39.8,25.28 680Ω_1.1
  Bottom 0.152: 680Ω_1.1 39.8,25.28 40.3,25.78 40.3,35.65 16.68,59.28 16.68,61.78 K1.7
N$26  (via drill 0.35)
  Top 0.152: D2.2 55.8,22.53 v54.93,21.65 54.05,20.78 51.3,20.78 49.93,19.4 49.68,19.4 IC2.3
  Bottom 0.152: v54.93,21.65 55.3,22.03 55.3,32.15 K2.4 55.18,32.28 49.55,37.9 49.55,53.4 K2.2
N$27  (via drill 0.35)
  Top 0.152: v45.55,15.78 46.43,15.78 46.68,15.53 R23.2 | v46.43,24.15 46.68,24.4 46.68,25.53 IC13.1
  Bottom 0.152: v45.55,15.78 46.43,16.65 v46.43,24.15
N$29  (via drill 0.35)
  Top 0.152: 38.05,42.9 38.05,48.53 37.93,48.53 K1.4 | 38.05,42.9 38.05,37.65 40.43,35.28 D1.2 40.55,35.15 v39.55,34.15 | v37.18,31.28 34.55,28.65 IC12.3 | 38.05,42.9 16.68,42.9 K1.2
  Bottom 0.152: v37.18,31.28 39.55,33.65 v39.55,34.15
N$37
  Top 0.152: IC14.4 30.8,17.9 31.05,17.9 33.43,15.53 R12.1 33.55,15.4 34.3,15.4 35.43,14.28 40.3,14.28 41.43,15.4 R29.1
N$38
  Top 0.152: R11.2 28.18,8.28 28.93,7.53 32.3,7.53 33.18,8.4 33.3,8.4 IC4.4
N$39
  Top 0.152: C7.1 80.06,43.4 79.56,42.9 78.56,42.9 77.81,42.15 77.81,41.53 IC11.15
N$41
  Top 0.152: IC15.6 78.93,21.53 78.93,19.28 82.43,19.28 84.06,20.9 84.06,21.53 IC15.2
N$42  (via drill 0.35)
  Top 0.152: v72.18,16.03 72.18,17.03 D9.2 | Q5.3 72.18,20.9 69.56,23.53 K6.1
  Bottom 0.152: v72.18,16.03 71.31,16.9 71.31,21.03 69.68,22.65 69.68,23.53 K6.1
N$43  (via drill 0.35)
  Top 0.152: C11.2 82.43,10.9 82.43,12.4 R10.1 82.31,12.53 82.18,12.53 v81.31,13.4 | v81.43,20.03 81.43,21.53 IC15.4
  Bottom 0.152: v81.43,20.03 81.31,19.9 v81.31,13.4
RESET_AMS  (via drill 0.35)
  Top 0.152: 40.93,17.15 39.18,17.15 R30.2 | 40.93,17.15 41.43,17.15 R29.2 | 51.93,25.28 50.93,24.28 50.55,24.28 48.68,22.4 v45.68,22.4 | 51.93,25.28 52.18,25.53 IC2.1 51.93,25.28 | 40.93,17.15 v42.05,18.28 | 51.93,25.28 52.68,25.28 53.18,24.78 57.68,24.78 63.43,30.53 86.93,30.53 86.93,27.15 88.14,25.85 RESET_AMS_IMD.1
  Bottom 0.152: v45.68,22.4 42.05,18.78 v42.05,18.28
RESET_BUTTON  (via drill 0.35)
  Top 0.152: R31.1 36.3,15.4 39.05,15.4 R30.1 39.18,15.4 39.3,15.28 v40.3,15.28
  Bottom 0.152: v40.3,15.28 41.18,14.4 41.18,4.15 X3.2
RESET_BUTTON_LED  (via drill 0.35)
  Top 0.152: Q3.3 34.68,21.65 33.68,21.65 33.3,21.28 32.05,21.28 31.8,21.03 R32.2 31.8,20.9 v31.8,18.9
  Bottom 0.152: v31.8,18.9 33.55,17.15 33.55,4.15 X3.5
RESET_IMD  (via drill 0.35)
  Top 0.152: 35.05,17.15 33.55,17.15 R12.2 | 35.05,17.15 36.18,17.15 R31.2 | v36.93,32.78 36.93,34.9 IC12.1 | 35.05,17.15 v35.05,17.28
  Bottom 0.152: v36.93,32.78 35.05,30.9 v35.05,17.28
RFE_IN
  Top 0.152: X2.2 54.05,4.03 56.18,6.15 64.06,6.15 67.43,2.78 68.43,2.78 K4.6
RFE_OUT
  Top 0.152: X2.1 56.55,3.9 57.8,2.65 60.8,2.65 K4.5
SC_HS  (via drill 0.35)
  Top 0.152: X1.4 84.43,61.78 83.93,61.78 83.93,56.28 85.81,54.4 86.18,54.4 86.18,48.28 85.18,47.28 R14.2 85.06,47.15 v84.18,46.28 | v83.81,23.4 84.81,23.4 84.93,23.53 R13.2 | D10.1 85.31,6.53 81.43,2.65 78.68,2.65 K4.8
  Bottom 0.152: K4.8 78.68,2.78 78.68,3.65 83.18,8.15 83.18,22.78 v83.81,23.4 83.81,23.66 84.31,24.16 84.31,46.15 v84.18,46.28
SC_IN
  Bottom 0.152: 6.68,8.4 6.68,8.28 | 14.93,4.28 X4.6
  Bottom 0.508: 14.93,4.28 10.93,8.28 6.68,8.28 | 6.68,8.4 K3.C
SC_IN_AMS
  Top 0.152: 5.68,61.9 K1.8 | 49.43,64.53 K2.1
  Top 0.508: 5.68,61.9 9.55,65.78 45.68,65.78 46.93,64.53 49.43,64.53
SC_IN_IMD
  Bottom 0.152: 6.55,33.65 K8.NO | 5.55,42.78 K1.1
  Bottom 0.508: 6.55,33.65 5.55,34.65 5.55,42.78
SC_IN_INVERTER
  Top 0.508: K3.NO 6.68,19.28 6.68,22.9 K8.C
SC_LS  (via drill 0.35)
  Top 0.152: X1.3 81.93,61.78 82.06,61.78 83.18,60.65 83.31,60.65 83.31,56.28 79.56,52.53 79.31,52.53 79.31,51.15 IC8.2 79.18,51.03 78.93,50.78 v78.31,50.78 | v80.81,6.78 81.81,6.78 81.93,6.65 D10.2
  Bottom 0.152: v80.81,6.78 78.68,8.9 78.68,10.28 K4.1 78.56,10.4 72.93,16.03 72.93,22.78 69.43,26.28 65.18,26.28 K6.2 65.18,26.4 65.18,37.65 v78.31,50.78
SC_OUT
  Top 0.152: 68.56,64.4 K2.8
  Top 0.508: 68.56,64.4 74.31,64.4 X1.1
VCU_FAULT
  Top 0.152: 6.68,2.28 2.43,6.53 2.43,11.15 2.18,11.15 K3.1 | 6.68,2.28 6.8,2.15 D3.1 6.68,2.28 | 6.68,2.28 7.55,2.28 8.68,3.4 11.68,3.4 12.68,2.4 18.3,2.4 20.05,4.15 X4.4

### Text on the board
tNames: Shutdown Circuit / logic